# Altium schematic sheet PasaBanda(BP).SchDoc
size A4
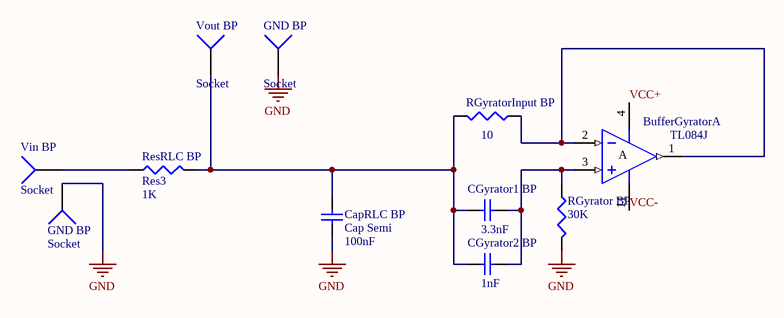
[diagram p0: PasaBanda(BP).SchDoc]

## Parts
(Parts that share a designator on the sheet are numbered #1, #2 ... from top to bottom, then left to right.)
BufferGyrator  TL084J  [J014]  (part A of 4)
CapRLC_BP  Cap Semi  value 100nF  [C0805]
CGyrator1_BP  value 3.3nF  [C0805]  (hidden comment: Cap Semi)
CGyrator2_BP  value 1nF  [C0805]  (hidden comment: Cap Semi)
GND_BP#1  Socket  [PIN1]
GND_BP#2  Socket  [PIN1]
ResRLC_BP  Res3  value 1K  [6-0805_M]
RGyrator_BP  value 30K  [6-0805_M]  (hidden comment: Res3)
RGyratorInput_BP  value 10  [6-0805_M]  (hidden comment: Res3)
Vin_BP  Socket  [PIN1]
Vout_BP  Socket  [PIN1]

## Nets
GND: CapRLC_BP.1 GND_BP#1.1 GND_BP#2.1 RGyrator_BP.2
VCC+: BufferGyrator.4(V+)
VCC-: BufferGyrator.11(V-)
NetBufferGyrator_1: BufferGyrator.1(OUT) BufferGyrator.2(IN-) RGyratorInput_BP.1
NetBufferGyrator_3: BufferGyrator.3(IN+) CGyrator1_BP.1 CGyrator2_BP.1 RGyrator_BP.1
NetCapRLC_BP_2: CapRLC_BP.2 CGyrator1_BP.2 CGyrator2_BP.2 ResRLC_BP.2 RGyratorInput_BP.2 Vout_BP.1
NetResRLC_BP_1: ResRLC_BP.1 Vin_BP.1

## Notes on the sheet
- (in symbol TL084J, part A) A

## Library data of the parts
BufferGyrator = TL084J: JFET-Input Operational Amplifier; Published: 16-Jan-2001; LatestRevisionDate: 04-Mar-2005; LatestRevisionNote: Stylized 3D Model Added.; DatasheetVersion: Feb-1999; PackageVersion: Jun-1999; PackageReference: J014; Publisher: Altium Limited; PackageDescription: DIP; 14 Leads; Row Spacing 7.62 mm; Pitch 2.54 mm; ComponentLink1Description: Manufacturer Link; ComponentLink1URL: http://www.ti.com/; ComponentLink2Description: Datasheet; ComponentLink2URL: http://www-s.ti.com/sc/ds/tl084.pdf
CapRLC_BP CGyrator1_BP CGyrator2_BP = Cap Semi: Capacitor (Semiconductor SIM Model); Published: 8-Jun-2000; LatestRevisionDate: 29-May-2009; LatestRevisionNote: IPC-7351 Footprint Added.; PackageReference: C1206; Publisher: Altium Limited; PackageDescription: Chip Capacitor
ResRLC_BP RGyrator_BP RGyratorInput_BP = Res3: Resistor; Published: 8-Jun-2000; LatestRevisionDate: 29-May-2009; LatestRevisionNote: IPC-7351 Footprint Added.; PackageReference: J1-0603; Publisher: Altium Limited; PackageDescription: Chip Resistor
GND_BP#1 GND_BP#2 Vin_BP Vout_BP = Socket: LatestRevisionDate: 17-Jul-2002; LatestRevisionNote: Re-released for DXP Platform.; Publisher: Altium Limited